# EAGLE schematic gt-jtx-m16-ver1.0 (EAGLE 6.3)
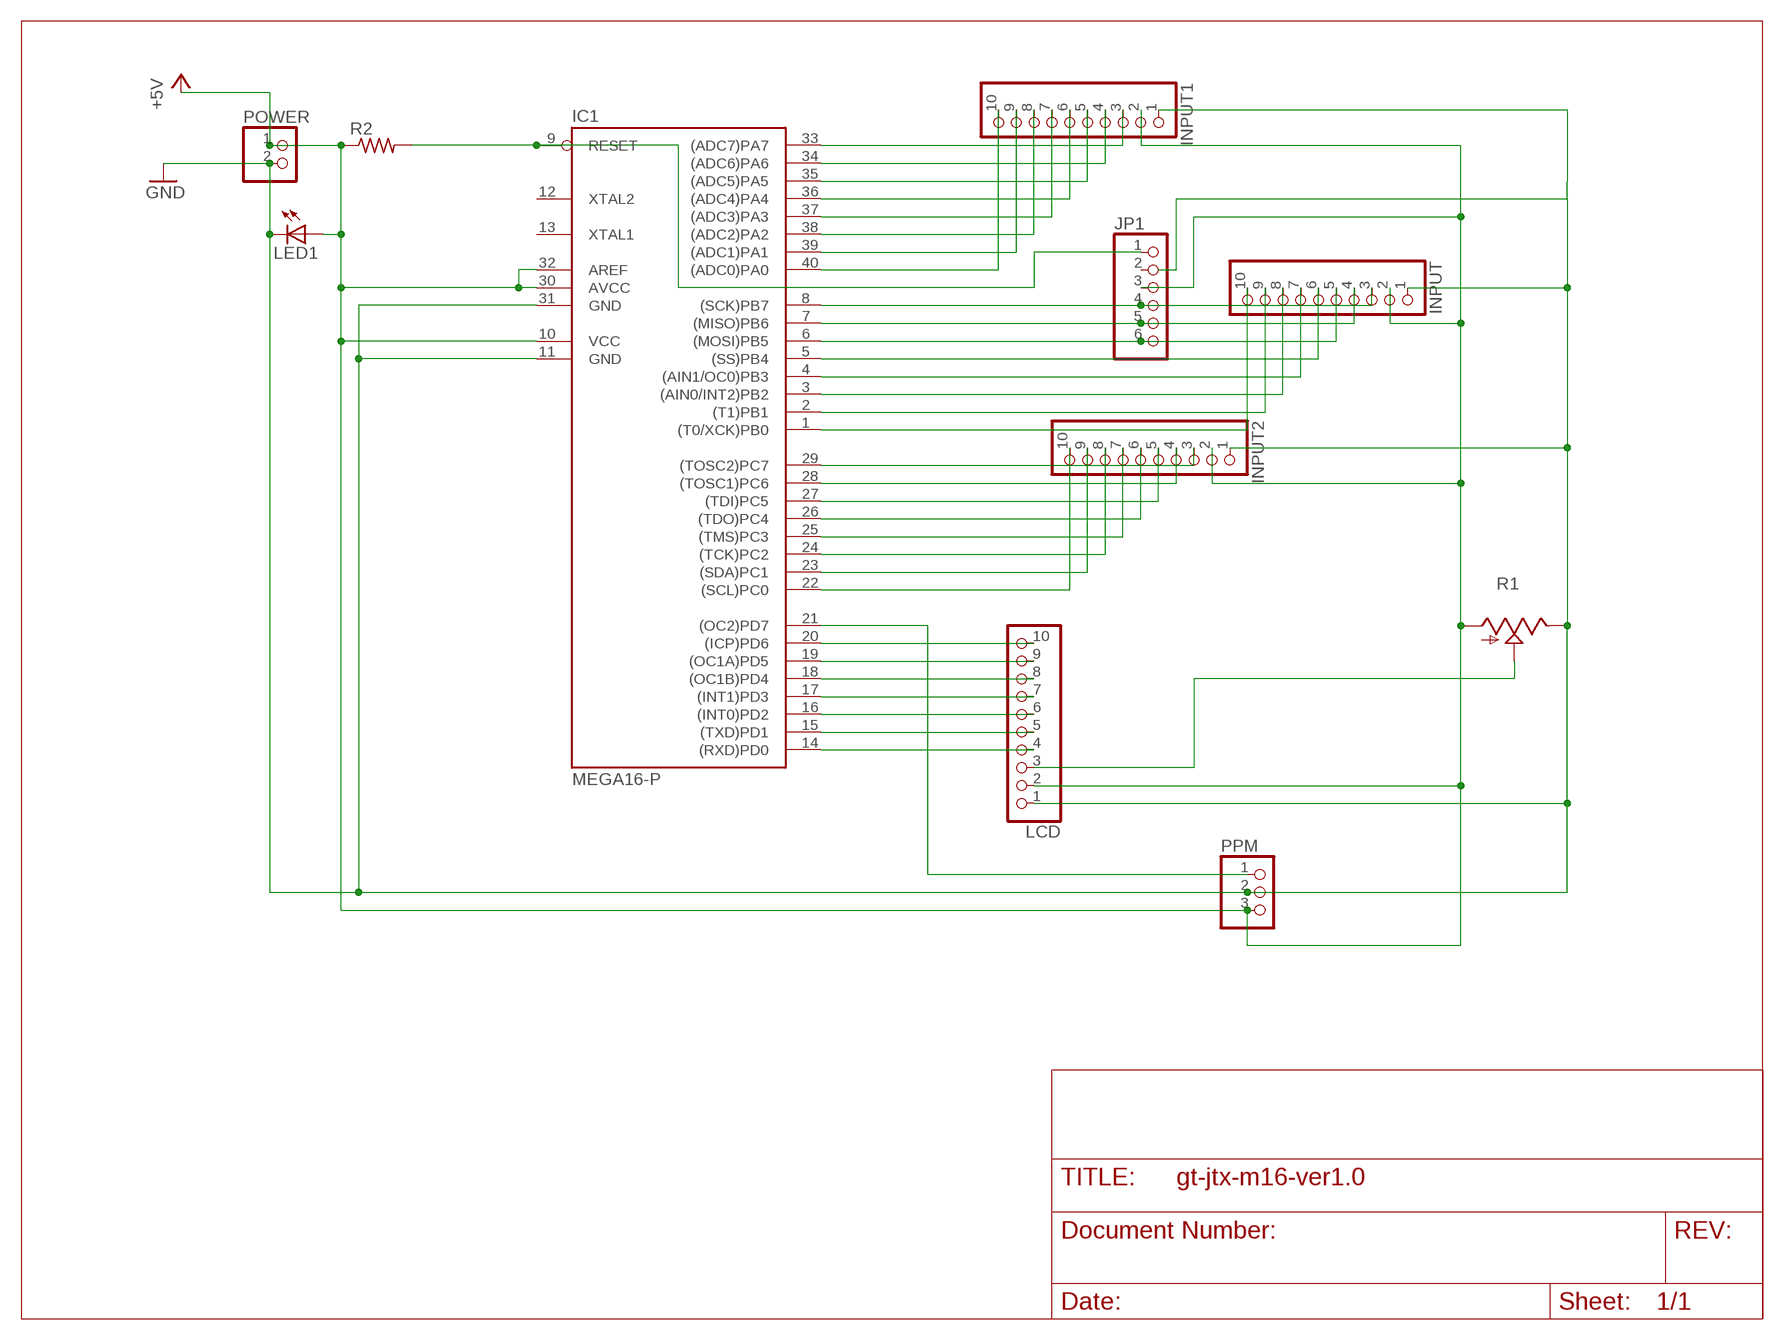
[diagram p0: schematic, sheet 1]

## Parts
IC1  MEGA16-P  [DIL40]
INPUT  PINHD-1X10  [1X10]
INPUT1  PINHD-1X10  [1X10]
INPUT2  PINHD-1X10  [1X10]
JP1  PINHD-1X6  [1X06]
LCD  PINHD-1X10  [1X10]
LED1  LED5MM  [LED5MM]
POWER  PINHD-1X2  [1X02]
PPM  PINHD-1X3  [1X03]
R1  TRIM_US-CA6V  [CA6V]
R2  R-US_0204/2V  [0204V]

## Nets
+5V: IC1.30(AVCC) IC1.32(AREF) INPUT1.2 INPUT2.2 INPUT.2 JP1.3 LCD.2 LED1.A POWER.1 PPM.3 R1.A R2.1
GND: INPUT1.1 INPUT2.1 INPUT.1 LCD.1 LED1.K(C) POWER.2 PPM.2 R1.E
N$1: IC1.40((ADC0)PA0) INPUT1.10
N$2: IC1.39((ADC1)PA1) INPUT1.9
N$3: IC1.38((ADC2)PA2) INPUT1.8
N$4: IC1.37((ADC3)PA3) INPUT1.7
N$5: IC1.20((ICP)PD6) LCD.10
N$6: IC1.19((OC1A)PD5) LCD.9
N$7: IC1.18((OC1B)PD4) LCD.8
N$8: IC1.36((ADC4)PA4) INPUT1.6
N$9: LCD.3 R1.S
N$10: IC1.35((ADC5)PA5) INPUT1.5
N$11: IC1.34((ADC6)PA6) INPUT1.4
N$12: IC1.17((INT1)PD3) LCD.7
N$13: IC1.16((INT0)PD2) LCD.6
N$14: IC1.15((TXD)PD1) LCD.5
N$15: IC1.14((RXD)PD0) LCD.4
N$16: IC1.21((OC2)PD7) PPM.1
N$17: IC1.33((ADC7)PA7) INPUT1.3
N$18: IC1.29((TOSC2)PC7) INPUT2.3
N$19: IC1.28((TOSC1)PC6) INPUT2.4
N$20: IC1.27((TDI)PC5) INPUT2.5
N$21: IC1.26((TDO)PC4) INPUT2.6
N$22: IC1.25((TMS)PC3) INPUT2.7
N$23: IC1.24((TCK)PC2) INPUT2.8
N$24: IC1.23((SDA)PC1) INPUT2.9
N$25: IC1.9(RESET) JP1.1 R2.2
N$26: IC1.22((SCL)PC0) INPUT2.10
N$27: IC1.1((T0/XCK)PB0) INPUT.10
N$28: IC1.8((SCK)PB7) INPUT.3 JP1.4
N$29: IC1.2((T1)PB1) INPUT.9
N$30: IC1.3((AIN0/INT2)PB2) INPUT.8
N$31: IC1.4((AIN1/OC0)PB3) INPUT.7
N$32: IC1.5((SS)PB4) INPUT.6
N$33: IC1.6((MOSI)PB5) INPUT.5 JP1.6
N$34: IC1.7((MISO)PB6) INPUT.4 JP1.5
Unconnected: IC1.12(XTAL2) IC1.13(XTAL1) JP1.2

## Power pins joined to a net without a drawn wire
GND: IC1.11(GND) IC1.31(GND)
VCC: IC1.10(VCC)

## Library data of the parts
IC1 = atmel:MEGA16-P: MICROCONTROLLER 16 Kbytes FLASH 1 kbytes SRAM 512 bytes EEPROM USART 8-channel 10 bit ADC Source: avr.lbr; MPN: ATMEGA16-16PU; OC_FARNELL: 9171142; OC_NEWARK: 01M6885
INPUT INPUT1 INPUT2 LCD = pinhead:PINHD-1X10: PIN HEADER
JP1 = pinhead:PINHD-1X6: PIN HEADER
LED1 = led:LED: LED OSRAM: - CHIPLED LG R971, LG N971, LY N971, LG Q971, LY Q971, LO R971, LY R971 LH N974, LH R974 LS Q976, LO Q976, LY Q976 LO Q996 - Hyper CHIPLED LW Q18S LB Q993, LB Q99A, LB R99A - SideLED LS A670, LO A670, LY A670, LG A670, LP A670 LB A673, LV A673, LT A673, LW A673 LH A674 LY A675 LS A676, LA A676, LO A676, LY A676, LW A676 LS A679, LY A679, LG A679 - Hyper Micro SIDELED® LS Y876, LA Y876, LO Y876, LY Y876 LT Y87S - SmartLED LW L88C, LW L88S LB L89C, LB L89S, LG L890 LS L89K, LO L89K, LY L89K LS L896, LA L896, LO L896, LY L896 - TOPLED LS T670, LO T670, LY T670, LG T670, LP T670 LSG T670, LSP T670, LSY T670, LOP T670, LYG T670 LG T671, LOG T671, LSG T671 LB T673, LV T673, LT T673, LW T673 LH T674 LS T676, LA T676, LO T676, LY T676, LB T676, LH T676, LSB T676, LW T676 LB T67C, LV T67C, LT T67C, LS T67K, LO T67K, LY T67K, LW E67C LS E67B, LA E67B, LO E67B, LY E67B, LB E67C, LV E67C, LT E67C LW T67C LS T679, LY T679, LG T679 LS T770, LO T770, LY T770, LG T770, LP T770 LB T773, LV T773, LT T773, LW T773 LH T774 LS E675, LA E675, LY E675, LS T675 LS T776, LA T776, LO T776, LY T776, LB T776 LHGB T686 LT T68C, LB T68C - Hyper Mini TOPLED® LB M676 - Mini TOPLED Santana® LG M470 LS M47K, LO M47K, LY M47K Source: http://www.osram.convergy.de LUXEON: - LUMILED® LXK2-PW12-R00, LXK2-PW12-S00, LXK2-PW14-U00, LXK2-PW14-V00 LXK2-PM12-R00, LXK2-PM12-S00, LXK2-PM14-U00 LXK2-PE12-Q00, LXK2-PE12-R00, LXK2-PE12-S00, LXK2-PE14-T00, LXK2-PE14-U00 LXK2-PB12-K00, LXK2-PB12-L00, LXK2-PB12-M00, LXK2-PB14-N00, LXK2-PB14-P00, LXK2-PB14-Q00 LXK2-PR12-L00, LXK2-PR12-M00, LXK2-PR14-Q00, LXK2-PR14-R00 LXK2-PD12-Q00, LXK2-PD12-R00, LXK2-PD12-S00 LXK2-PH12-R00, LXK2-PH12-S00 LXK2-PL12-P00, LXK2-PL12-Q00, LXK2-PL12-R00 Source: www.luxeon.com KINGBRIGHT: KA-3528ASYC Source: www.kingbright.com
POWER = pinhead:PINHD-1X2: PIN HEADER
PPM = pinhead:PINHD-1X3: PIN HEADER
R1 = pot:TRIM_US-: POTENTIOMETER
R2 = resistor:R-US_: RESISTOR, American symbol